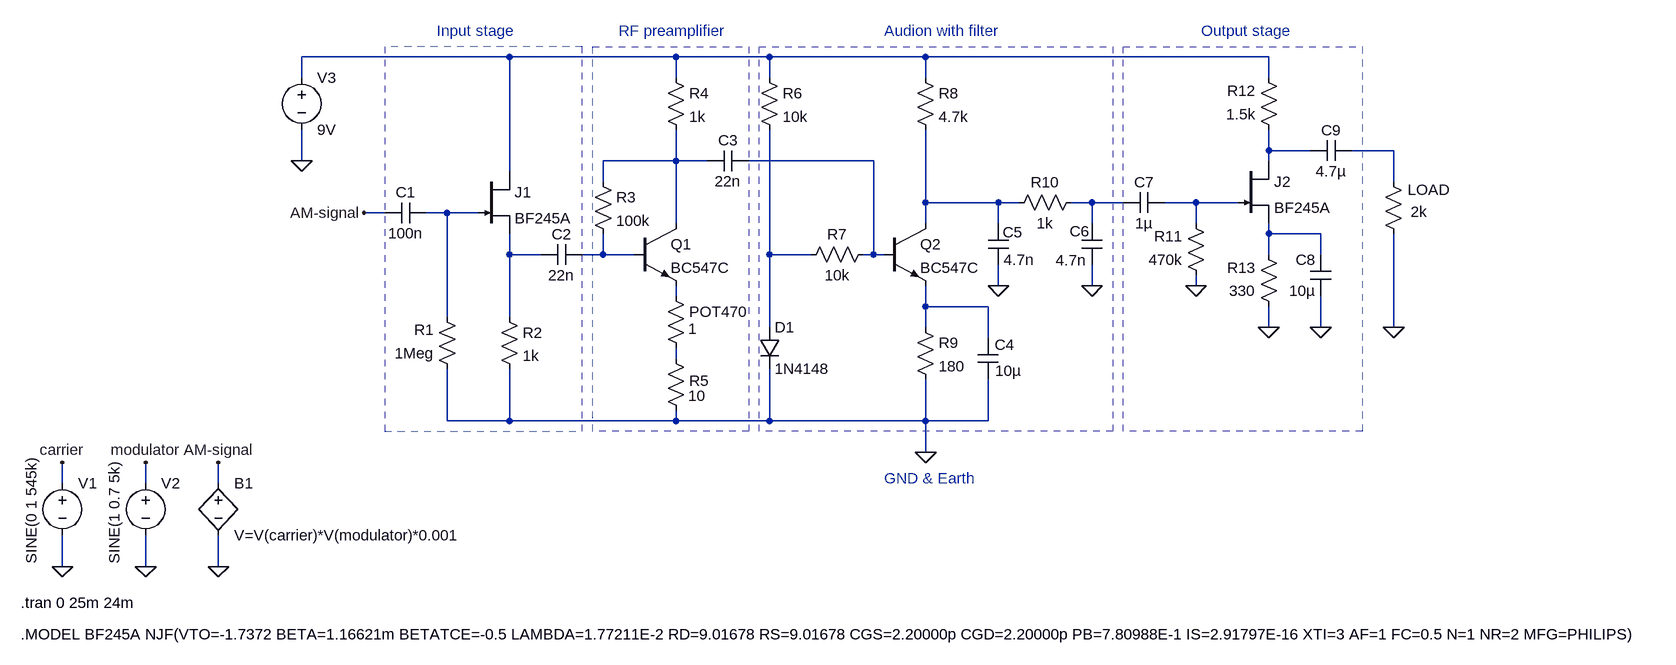
[diagram p0: schematic audion-receiver-2.asc]
audion-receiver-2.asc, the LTspice schematic file:
Version 4
SHEET 1 1944 680
WIRE -48 -368 -368 -368
WIRE 208 -368 -48 -368
WIRE 352 -368 208 -368
WIRE 592 -368 352 -368
WIRE 1120 -368 592 -368
WIRE -368 -336 -368 -368
WIRE 208 -336 208 -368
WIRE 352 -336 352 -368
WIRE 592 -336 592 -368
WIRE 1120 -336 1120 -368
WIRE 1120 -224 1120 -256
WIRE 1184 -224 1120 -224
WIRE 1312 -224 1248 -224
WIRE -368 -208 -368 -256
WIRE 208 -208 208 -256
WIRE 208 -208 96 -208
WIRE 256 -208 208 -208
WIRE 512 -208 320 -208
WIRE 1120 -208 1120 -224
WIRE -48 -192 -48 -368
WIRE 96 -176 96 -208
WIRE 1312 -176 1312 -224
WIRE 592 -144 592 -256
WIRE 704 -144 592 -144
WIRE 736 -144 704 -144
WIRE 848 -144 816 -144
WIRE 896 -144 848 -144
WIRE 1008 -144 960 -144
WIRE 1072 -144 1008 -144
WIRE -240 -128 -272 -128
WIRE -144 -128 -176 -128
WIRE -96 -128 -144 -128
WIRE 208 -112 208 -208
WIRE 592 -112 592 -144
WIRE 704 -112 704 -144
WIRE 848 -112 848 -144
WIRE 1008 -112 1008 -144
WIRE 1120 -96 1120 -112
WIRE 1200 -96 1120 -96
WIRE -48 -64 -48 -96
WIRE 0 -64 -48 -64
WIRE 96 -64 96 -96
WIRE 96 -64 64 -64
WIRE 144 -64 96 -64
WIRE 352 -64 352 -256
WIRE 416 -64 352 -64
WIRE 512 -64 512 -208
WIRE 512 -64 496 -64
WIRE 528 -64 512 -64
WIRE 1120 -64 1120 -96
WIRE 1200 -64 1200 -96
WIRE 704 -16 704 -48
WIRE 848 -16 848 -48
WIRE 1008 -16 1008 -32
WIRE 208 0 208 -16
WIRE 592 16 592 -16
WIRE 688 16 592 16
WIRE -144 32 -144 -128
WIRE -48 32 -48 -64
WIRE 352 48 352 -64
WIRE 592 48 592 16
WIRE 1120 48 1120 16
WIRE 1200 48 1200 0
WIRE 1312 48 1312 -96
WIRE 688 64 688 16
WIRE 208 96 208 80
WIRE -144 192 -144 112
WIRE -48 192 -48 112
WIRE -48 192 -144 192
WIRE 208 192 208 176
WIRE 208 192 -48 192
WIRE 352 192 352 112
WIRE 352 192 208 192
WIRE 592 192 592 128
WIRE 592 192 352 192
WIRE 688 192 688 128
WIRE 688 192 592 192
WIRE 592 240 592 192
WIRE -736 288 -736 256
WIRE -608 288 -608 256
WIRE -496 288 -496 256
WIRE -736 416 -736 368
WIRE -608 416 -608 368
WIRE -496 416 -496 368
FLAG 592 240 0
FLAG -736 256 carrier
FLAG -608 256 modulator
FLAG -736 416 0
FLAG -608 416 0
FLAG -496 416 0
FLAG -496 256 AM-signal
FLAG -368 -208 0
FLAG 704 -16 0
FLAG 848 -16 0
FLAG 1008 -16 0
FLAG 1120 48 0
FLAG 1200 48 0
FLAG 1312 48 0
FLAG -272 -128 AM-signal
SYMBOL npn 528 -112 R0
SYMATTR InstName Q2
SYMATTR Value BC547C
SYMBOL res 576 -352 R0
SYMATTR InstName R8
SYMATTR Value 4.7k
SYMBOL res 336 -352 R0
SYMATTR InstName R6
SYMATTR Value 10k
SYMBOL res 512 -80 R90
WINDOW 0 0 56 VBottom 2
WINDOW 3 32 56 VTop 2
SYMATTR InstName R7
SYMATTR Value 10k
SYMBOL diode 336 48 R0
SYMATTR InstName D1
SYMATTR Value 1N4148
SYMBOL res 576 32 R0
SYMATTR InstName R9
SYMATTR Value 180
SYMBOL voltage -736 272 R0
WINDOW 3 -48 -25 VRight 2
WINDOW 123 0 0 Left 0
WINDOW 39 0 0 Left 0
SYMATTR Value SINE(0 1 545k)
SYMATTR InstName V1
SYMBOL voltage -608 272 R0
WINDOW 3 -48 -18 VRight 2
WINDOW 123 0 0 Left 0
WINDOW 39 0 0 Left 0
SYMATTR Value SINE(1 0.7 5k)
SYMATTR InstName V2
SYMBOL bv -496 272 R0
SYMATTR InstName B1
SYMATTR Value V=V(carrier)*V(modulator)*0.001
SYMBOL voltage -368 -352 R0
WINDOW 123 0 0 Left 0
WINDOW 39 0 0 Left 0
SYMATTR InstName V3
SYMATTR Value 9V
SYMBOL cap 688 -112 R0
WINDOW 0 23 14 Left 2
SYMATTR InstName C5
SYMATTR Value 4.7n
SYMBOL cap 832 -112 R0
WINDOW 0 -18 12 Left 2
WINDOW 3 -40 57 Left 2
SYMATTR InstName C6
SYMATTR Value 4.7n
SYMBOL res 832 -160 R90
WINDOW 0 0 56 VBottom 2
WINDOW 3 32 56 VTop 2
SYMATTR InstName R10
SYMATTR Value 1k
SYMBOL cap 960 -160 R90
WINDOW 0 0 32 VBottom 2
WINDOW 3 32 32 VTop 2
SYMATTR InstName C7
SYMATTR Value 1µ
SYMBOL njf 1072 -208 R0
SYMATTR InstName J2
SYMATTR Value BF245A
SYMBOL res 1024 -16 R180
WINDOW 0 36 76 Left 2
WINDOW 3 36 40 Left 2
SYMATTR InstName R11
SYMATTR Value 470k
SYMBOL res 1136 32 R180
WINDOW 0 36 76 Left 2
WINDOW 3 36 40 Left 2
SYMATTR InstName R13
SYMATTR Value 330
SYMBOL res 1136 -240 R180
WINDOW 0 36 76 Left 2
WINDOW 3 36 40 Left 2
SYMATTR InstName R12
SYMATTR Value 1.5k
SYMBOL cap 1216 0 R180
WINDOW 0 24 56 Left 2
WINDOW 3 24 8 Left 2
SYMATTR InstName C8
SYMATTR Value 10µ
SYMBOL cap 1248 -240 R90
WINDOW 0 0 32 VBottom 2
WINDOW 3 32 32 VTop 2
SYMATTR InstName C9
SYMATTR Value 4.7µ
SYMBOL res 1328 -80 R180
WINDOW 0 -71 84 Left 2
WINDOW 3 -36 50 Left 2
SYMATTR InstName LOAD
SYMATTR Value 2k
SYMBOL cap 704 128 R180
WINDOW 0 -25 53 Left 2
WINDOW 3 -36 13 Left 2
SYMATTR InstName C4
SYMATTR Value 10µ
SYMBOL res 192 80 R0
WINDOW 0 36 50 Left 2
WINDOW 3 35 73 Left 2
SYMATTR InstName R5
SYMATTR Value 10
SYMBOL cap -176 -144 R90
WINDOW 0 0 32 VBottom 2
WINDOW 3 32 32 VTop 2
SYMATTR InstName C1
SYMATTR Value 100n
SYMBOL npn 144 -112 R0
SYMATTR InstName Q1
SYMATTR Value BC547C
SYMBOL res 192 -352 R0
SYMATTR InstName R4
SYMATTR Value 1k
SYMBOL res 80 -192 R0
SYMATTR InstName R3
SYMATTR Value 100k
SYMBOL cap 320 -224 R90
WINDOW 0 0 32 VBottom 2
WINDOW 3 32 32 VTop 2
SYMATTR InstName C3
SYMATTR Value 22n
SYMBOL njf -96 -192 R0
SYMATTR InstName J1
SYMATTR Value BF245A
SYMBOL res -64 16 R0
SYMATTR InstName R2
SYMATTR Value 1k
SYMBOL cap 64 -80 R90
WINDOW 0 0 32 VBottom 2
WINDOW 3 32 32 VTop 2
SYMATTR InstName C2
SYMATTR Value 22n
SYMBOL res -128 128 R180
WINDOW 0 36 76 Left 2
WINDOW 3 36 40 Left 2
SYMATTR InstName R1
SYMATTR Value 1Meg
SYMBOL res 192 -16 R0
WINDOW 3 35 66 Left 2
SYMATTR InstName POT470
SYMATTR Value 1
TEXT -800 472 Left 2 !.tran 0 25m 24m
TEXT -800 520 Left 2 !.MODEL BF245A NJF(VTO=-1.7372 BETA=1.16621m BETATCE=-0.5 LAMBDA=1.77211E-2 RD=9.01678 RS=9.01678 CGS=2.20000p CGD=2.20000p PB=7.80988E-1 IS=2.91797E-16 XTI=3 AF=1 FC=0.5 N=1 NR=2 MFG=PHILIPS)
TEXT -160 -408 Left 2 ;Input stage
TEXT 120 -408 Left 2 ;RF preamplifier
TEXT 528 -408 Left 2 ;Audion with filter
TEXT 1016 -408 Left 2 ;Output stage
TEXT 528 280 Left 2 ;GND & Earth
RECTANGLE Normal 320 208 80 -384 2
RECTANGLE Normal -240 208 64 -384 2
RECTANGLE Normal 880 208 336 -384 2
RECTANGLE Normal 1264 208 896 -384 2

The netlist it stands for:
* audion-receiver-2.asc
Q2 N006 N005 N015 0 BC547C
R8 N001 N006 4.7k
R6 N001 N013 10k
R7 N005 N013 10k
D1 N013 0 1N4148
R9 N015 0 180
V1 carrier 0 SINE(0 1 545k)
V2 modulator 0 SINE(1 0.7 5k)
B1 AM-signal 0 V=V(carrier)*V(modulator)*0.001
V3 N001 0 9V
C5 N006 0 4.7n
C6 N007 0 4.7n
R10 N007 N006 1k
C7 N008 N007 1µ
J2 N002 N008 N010 BF245A
R11 0 N008 470k
R13 0 N010 330
R12 N002 N001 1.5k
C8 0 N010 10µ
C9 N003 N002 4.7µ
R§LOAD 0 N003 2k
C4 0 N015 10µ
R5 N016 0 10
C1 N009 AM-signal 100n
Q1 N004 N012 N014 0 BC547C
R4 N001 N004 1k
R3 N004 N012 100k
C3 N005 N004 22n
J1 N001 N009 N011 BF245A
R2 N011 0 1k
C2 N012 N011 22n
R1 0 N009 1Meg
R§POT470 N014 N016 1
.model D D
.lib standard.dio
.model NPN NPN
.model PNP PNP
.lib standard.bjt
.model NJF NJF
.model PJF PJF
.lib standard.jft
.tran 0 25m 24m
.MODEL BF245A NJF(VTO=-1.7372 BETA=1.16621m BETATCE=-0.5 LAMBDA=1.77211E-2 RD=9.01678 RS=9.01678 CGS=2.20000p CGD=2.20000p PB=7.80988E-1 IS=2.91797E-16 XTI=3 AF=1 FC=0.5 N=1 NR=2 MFG=PHILIPS)
* Input stage
* RF preamplifier
* Audion with filter
* Output stage
* GND & Earth
.backanno
.end